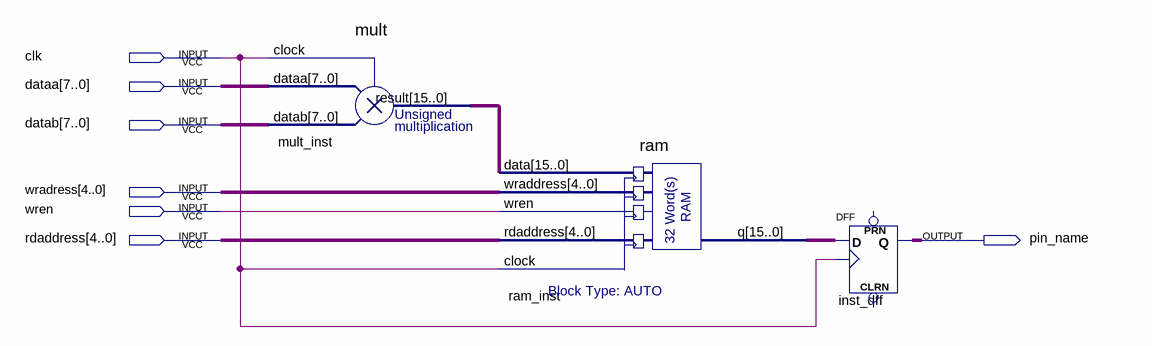
[diagram p0: schematic sheet]
// Quartus schematic Block1.bdf as structural Verilog: 3 symbols, 7 pins
module Block1 (
  input  clk,
  input  [7:0] dataa,
  input  [7:0] datab,
  input  [4:0] wradress,
  input  wren,
  input  [4:0] rdaddress,
  output pin_name
);

  wire [15:0] inst_dff_q, mult_inst_result, ram_inst_q;

  mult mult_inst (.dataa(dataa), .datab(datab), .clock(clk), .result(mult_inst_result));
  ram ram_inst (
    .data(mult_inst_result), .wraddress(wradress), .wren(wren), .rdaddress(rdaddress), .clock(clk),
    .q(ram_inst_q));
  DFF inst_dff[15:0] (.CLK(clk), .D(ram_inst_q), .Q(inst_dff_q));  // open: CLRN, PRN
endmodule
